# EAGLE design avr_programming_shield_v2 (EAGLE 6.3)
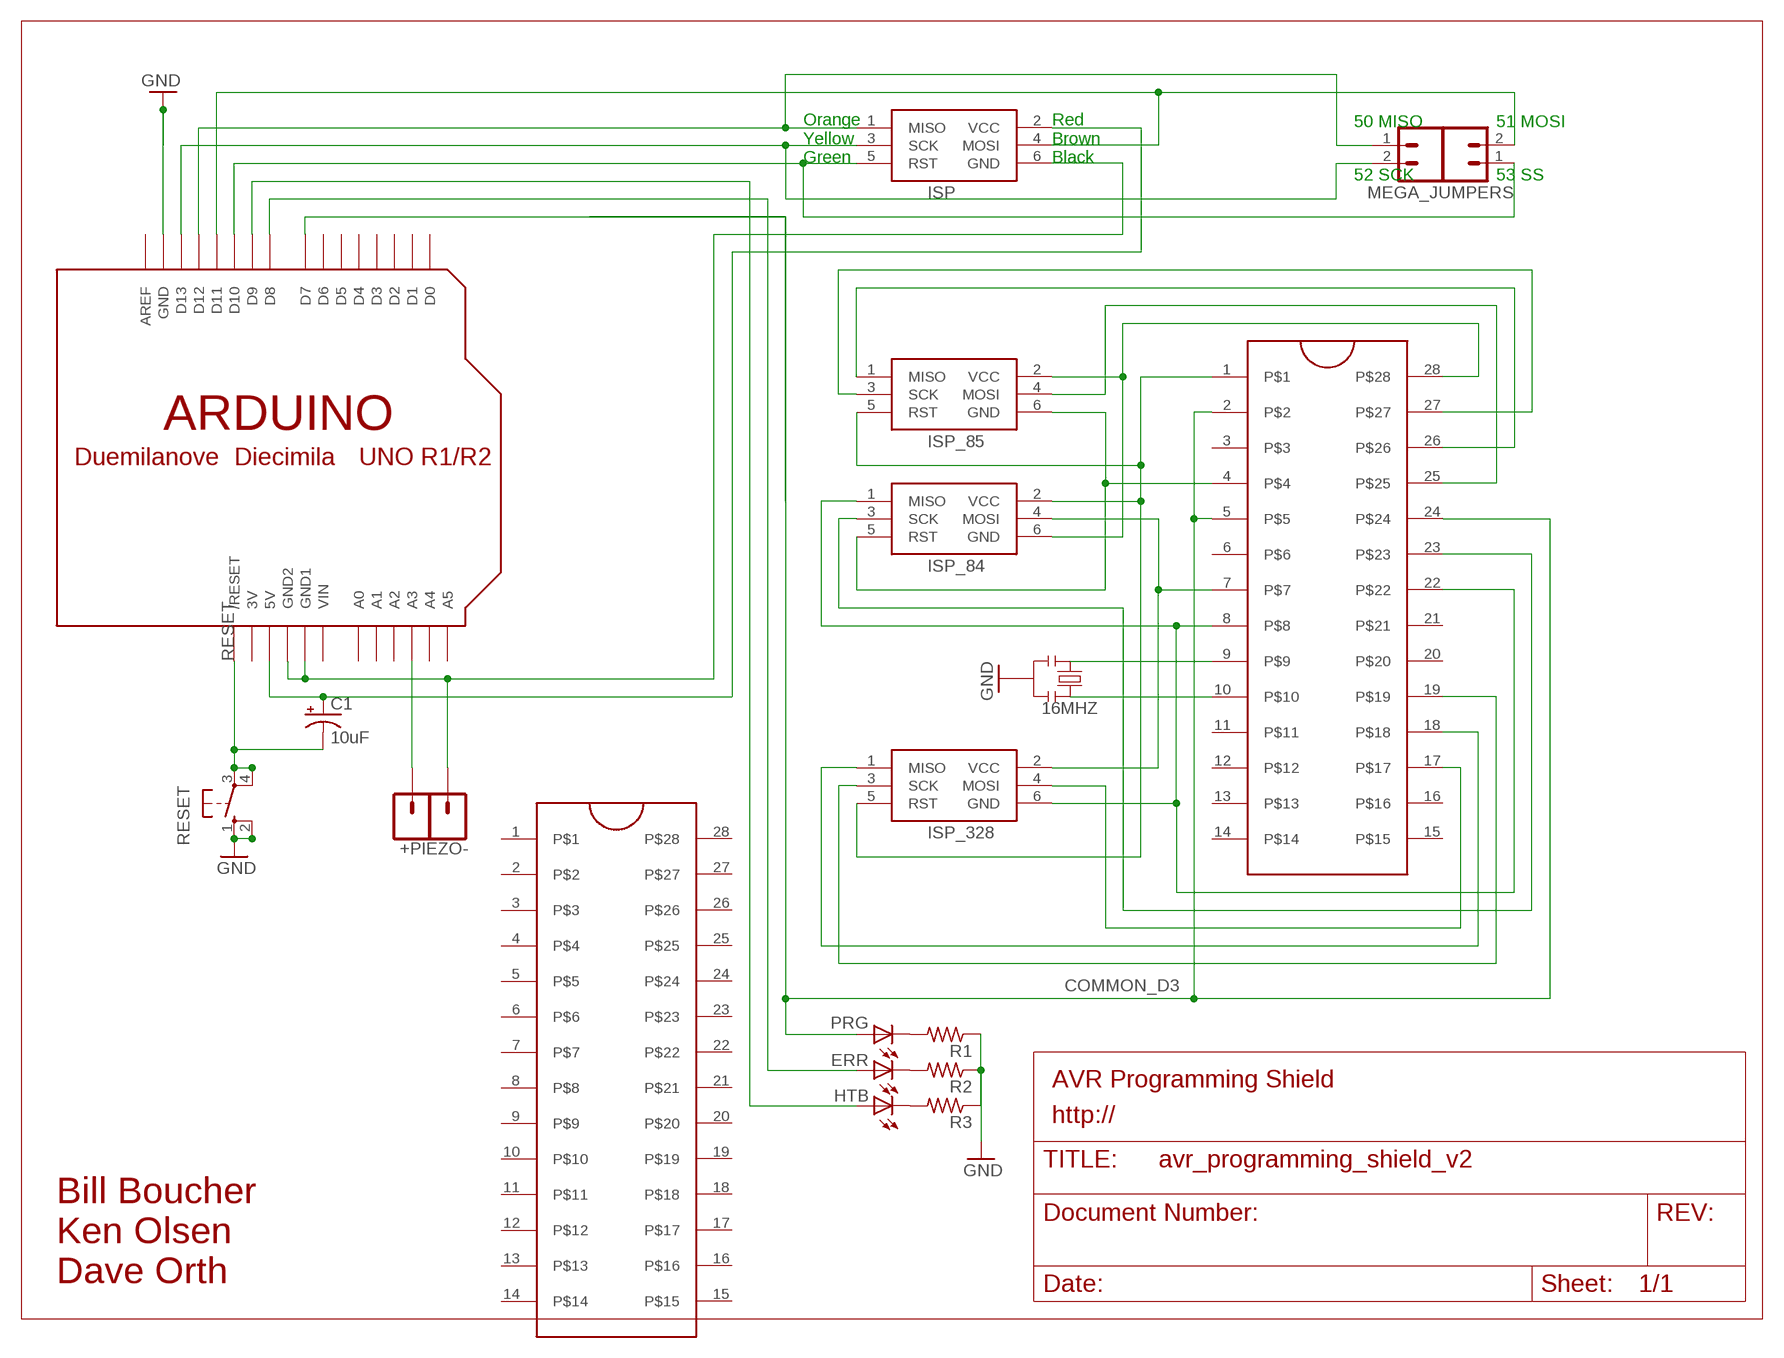
[diagram p0: schematic, sheet 1]

## Parts
16MHZ  RESONATORPTH  [RESONATOR-PTH]
+PIEZO-  M01PTH  [1X01]
C1  10uF  CAP_POLPTH2  [CPOL-RADIAL-10UF-25V]
ERR  LED3MM  [LED3MM]
HTB  LED3MM  [LED3MM]
ISP  AVRISP-6  [AVRISP]
ISP_84  AVRISP-6  [AVRISP]
ISP_85  AVRISP-6  [AVRISP]
ISP_328  AVRISP-6  [AVRISP]
JP2  M02PTH  [1X02]
JP4  M01PTH  [1X01]
MEGA_JUMPERS  M02PTH  [1X02]
PRG  LED3MM  [LED3MM]
R1  R-US_0204/2V  [0204V]
R2  R-US_0204/2V  [0204V]
R3  R-US_0204/2V  [0204V]
RESET  10-XX  [B3F-10XX]
U$1  ARDUINO-NOHOLE  [ARDUINO-NOHOLE]
U$3  ZIFSOCKET-28-3ZIFFSOCKET-28-3  [DIL28-3-ZIF_SOCKET]
U$4  ZIFSOCKET-28-3ZIFFSOCKET-28-3  [DIL28-3-ZIF_SOCKET]

## Nets
COMMON_D3: PRG.A U$1.D7 U$4.2 U$4.5 U$4.24
GND [power]: 16MHZ.2 +PIEZO-.1 ISP.6(GND) R1.1 R2.1 R3.1 RESET.1(S) RESET.2(S1) U$1.GND U$1.GND1 U$1.GND2
N$1: ISP_328.4(MOSI) U$4.17
N$2: ISP.3(SCK) MEGA_JUMPERS.2 U$1.D13
N$3: ISP.1(MISO) MEGA_JUMPERS.1 U$1.D12
N$4: ISP_328.1(MISO) U$4.18
N$5: ISP.5(RST) JP2.1 U$1.D10
N$6: ISP.4(MOSI) JP2.2 U$1.D11
N$7: ISP_328.3(SCK) U$4.19
N$8: PRG.K(C) R1.2
N$9: ERR.K(C) R2.2
N$10: HTB.K(C) R3.2
N$11: ISP_84.4(MOSI) ISP_328.2(VCC) U$4.7
N$12: JP4.1 U$1.A3
N$13: ISP_84.2(VCC) ISP_85.5(RST) ISP_328.5(RST) U$4.1
N$15: ISP_84.3(SCK) U$4.23
N$16: ISP_84.6(GND) ISP_85.2(VCC) U$4.28
N$17: HTB.A U$1.D9
N$18: ISP_84.5(RST) ISP_85.6(GND) U$4.4
N$19: ISP_85.4(MOSI) U$4.25
N$20: ISP_85.1(MISO) U$4.26
N$21: ISP_85.3(SCK) U$4.27
N$22: 16MHZ.1 U$4.9
N$24: ERR.A U$1.D8
N$25: 16MHZ.3 U$4.10
N$26: ISP_84.1(MISO) ISP_328.6(GND) U$4.8 U$4.22
RESET: C1.2(-) RESET.3(P) RESET.4(P1) U$1.RESET(/RESET)
VCC: C1.1(+) ISP.2(VCC) U$1.5V
Unconnected: U$1.A0 U$1.A1 U$1.A2 U$1.A4 U$1.A5 U$1.AREF U$1.D0 U$1.D1 U$1.D2 U$1.D3 U$1.D4 U$1.D5 U$1.D6 U$3.1 U$3.2 U$3.3 U$3.4 U$3.5 U$3.6 U$3.7 U$3.8 U$3.9 U$3.10 U$3.11 U$3.12 U$3.13 U$3.14 U$3.15 U$3.16 U$3.17 U$3.18 U$3.19 U$3.20 U$3.21 U$3.22 U$3.23 U$3.24 U$3.25 U$3.26 U$3.27 U$3.28 U$4.3 U$4.6 U$4.11 U$4.12 U$4.13 U$4.14 U$4.15 U$4.16 U$4.20 U$4.21

## Notes on the sheet
- 50 MISO | 51 MOSI
- Orange
  Yellow
  Green
- Red
  Brown
  Black
- 52 SCK | 53 SS
- AVR Programming Shield
- http://
- Bill Boucher
  Ken Olsen
  Dave Orth

## Power pins joined to a net without a drawn wire
3V: U$1.3V
VIN: U$1.VIN

## Library data of the parts
16MHZ = SparkFun_mod:RESONATOR: Resonator Small SMD resonator. This is the itty bitty 10/20MHz resonators with built in caps. CSTCE10M0G55 and CSTCE20M0V53. Footprint has been reviewed closely but hasn't been tested yet.; OC_NEWARK: unknown
+PIEZO- JP4 = SparkFun-Connectors_mod:M01: Header 1 Standard 1-pin 0.1" header. Use with straight break away headers (SKU : PRT-00116), right angle break away headers (PRT-00553), swiss pins (PRT-00743), machine pins (PRT-00117), and female headers (PRT-00115).; OC_NEWARK: unknown
C1 = SparkFun:CAP_POL: Capacitor Polarized These are standard SMD and PTH capacitors. Normally 10uF, 47uF, and 100uF in electrolytic and tantalum varieties. Always verify the external diameter of the through hole cap, it varies with capacity, voltage, and manufacturer. The EIA devices should be standard.; MF: ILLINOIS CAPACITOR,INC.; MPN: 106TTA035M; OC_NEWARK: 30K6594
ERR HTB PRG = adafruit:LED: LED OSRAM: - CHIPLED LG R971, LG N971, LY N971, LG Q971, LY Q971, LO R971, LY R971 LH N974, LH R974 LS Q976, LO Q976, LY Q976 LO Q996 - Hyper CHIPLED LW Q18S LB Q993, LB Q99A, LB R99A - SideLED LS A670, LO A670, LY A670, LG A670, LP A670 LB A673, LV A673, LT A673, LW A673 LH A674 LY A675 LS A676, LA A676, LO A676, LY A676, LW A676 LS A679, LY A679, LG A679 - Hyper Micro SIDELED® LS Y876, LA Y876, LO Y876, LY Y876 LT Y87S - SmartLED LW L88C, LW L88S LB L89C, LB L89S, LG L890 LS L89K, LO L89K, LY L89K LS L896, LA L896, LO L896, LY L896 - TOPLED LS T670, LO T670, LY T670, LG T670, LP T670 LSG T670, LSP T670, LSY T670, LOP T670, LYG T670 LG T671, LOG T671, LSG T671 LB T673, LV T673, LT T673, LW T673 LH T674 LS T676, LA T676, LO T676, LY T676, LB T676, LH T676, LSB T676, LW T676 LB T67C, LV T67C, LT T67C, LS T67K, LO T67K, LY T67K, LW E67C LS E67B, LA E67B, LO E67B, LY E67B, LB E67C, LV E67C, LT E67C LW T67C LS T679, LY T679, LG T679 LS T770, LO T770, LY T770, LG T770, LP T770 LB T773, LV T773, LT T773, LW T773 LH T774 LS E675, LA E675, LY E675, LS T675 LS T776, LA T776, LO T776, LY T776, LB T776 LHGB T686 LT T68C, LB T68C - Hyper Mini TOPLED® LB M676 - Mini TOPLED Santana® LG M470 LS M47K, LO M47K, LY M47K Source: http://www.osram.convergy.de/; OC_NEWARK: unknown
ISP ISP_84 ISP_85 ISP_328 = adafruit:AVRISP: AVR ISP HEADER Standard 6 pin header for AVR programming; OC_NEWARK: unknown
JP2 MEGA_JUMPERS = SparkFun:M02: Header 2 Standard 2-pin 0.1" header. Use with straight break away headers (SKU : PRT-00116), right angle break away headers (PRT-00553), swiss pins (PRT-00743), machine pins (PRT-00117), and female headers (PRT-00115). Molex polarized connector foot print use with SKU : PRT-08233 with associated crimp pins and housings.; OC_NEWARK: unknown
R1-R3 = adafruit:R-US_: RESISTOR, American symbol; OC_NEWARK: unknown
RESET = switch-omron:10-XX: OMRON SWITCH; MPN: B3F-1000; OC_FARNELL: 176432; OC_NEWARK: 36M3542
U$1 = adafruit:ARDUINO: Arduino Diecimila/Duemilanove Make a shield with ease, this package has all the named pins as well as the two mounting drill holes and an outline of the USB and DC power connector. The outline is on the DIMENSION layer, so if your board house uses it they will cut the outline to match. http://www.ladyada.net/library/pcb/eaglelibrary.html; OC_NEWARK: unknown
U$3 = SparkFun:ZIFSOCKET-28-3
U$4 = SparkFun_mod:ZIFSOCKET-28-3; OC_NEWARK: unknown

## Net classes
1 power: width 0.61 mm

## Board
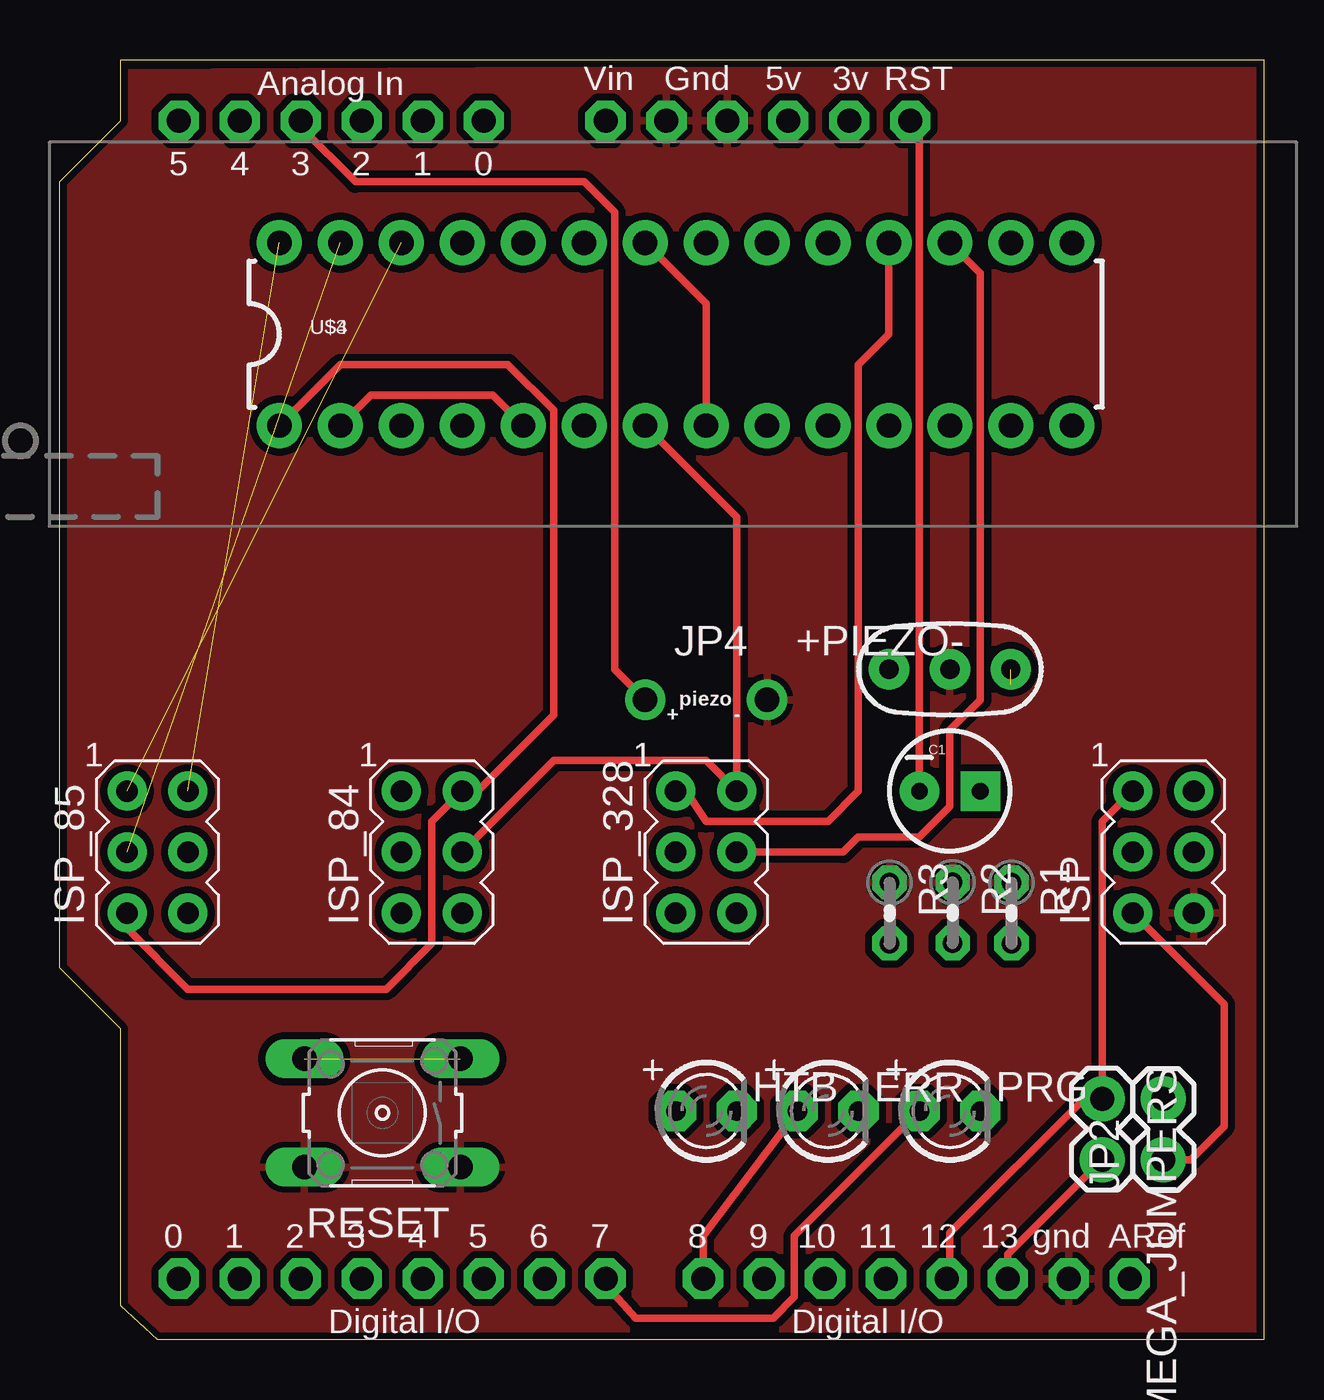
[diagram p1: board, top side]
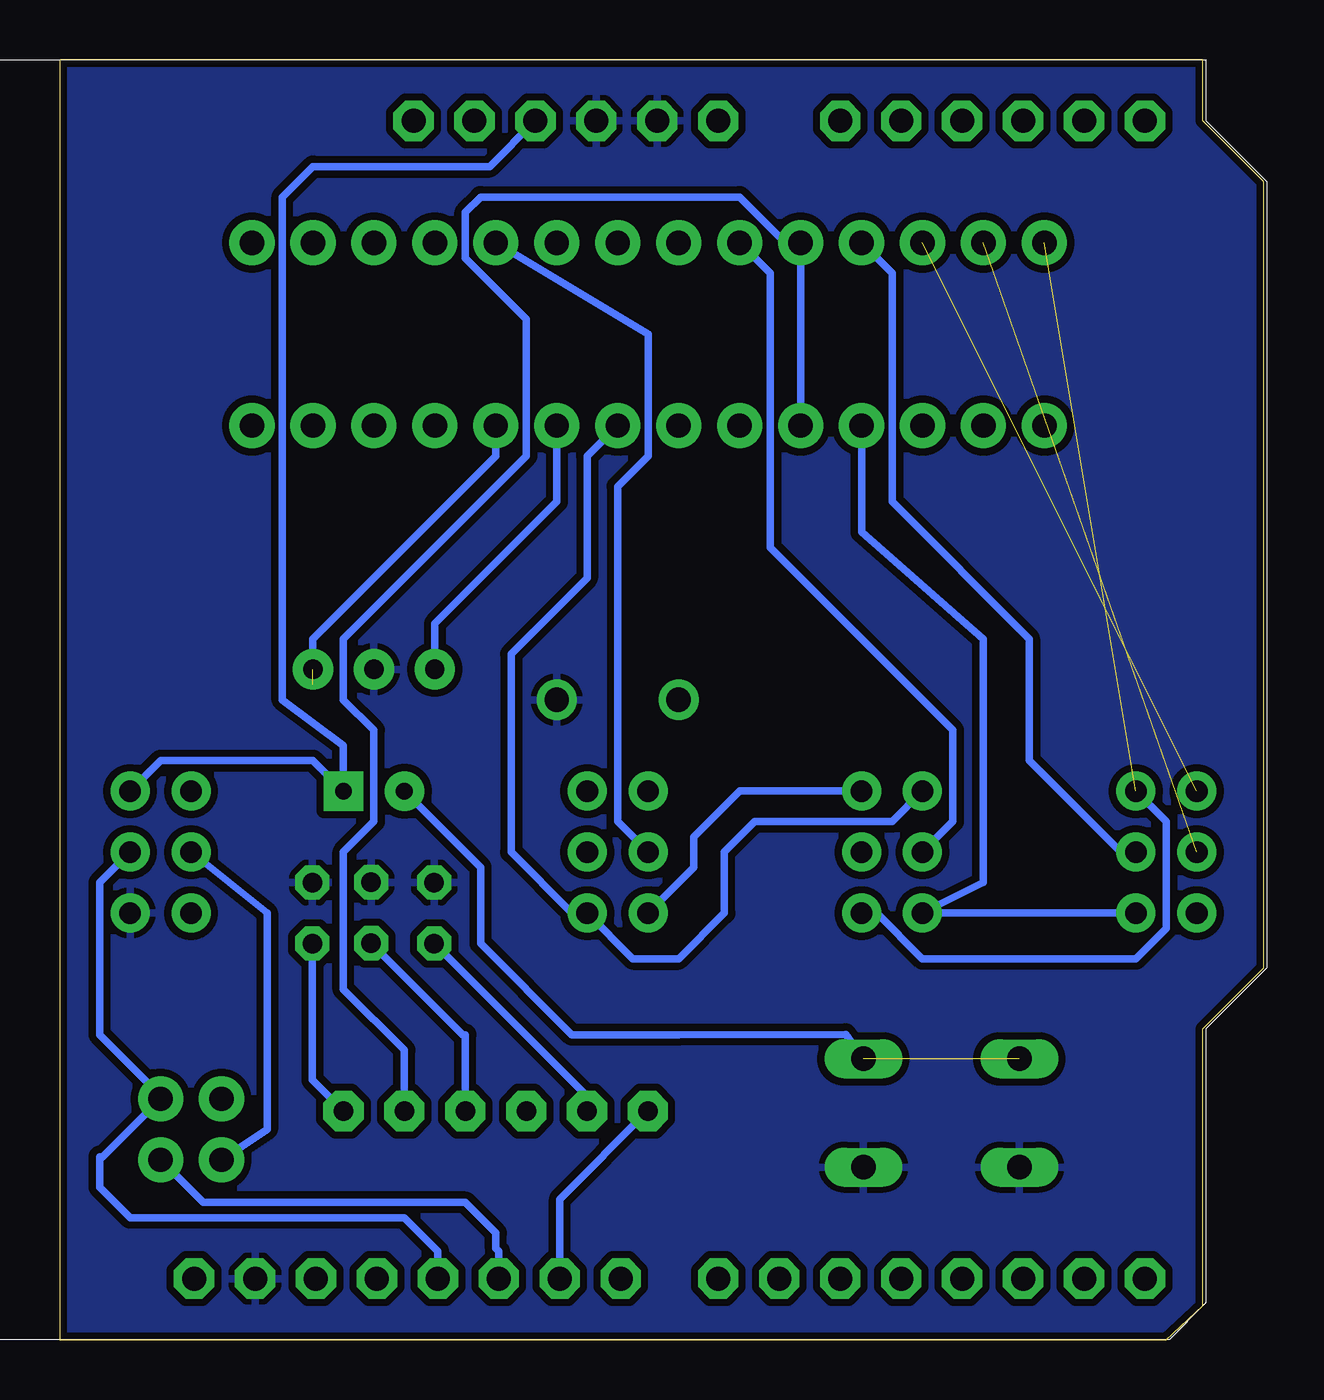
[diagram p2: board, bottom side, seen from below]

Size 50.16 x 53.34 mm. Coordinates in mm from the lower left corner, seen from the top.
Outline: 2.54,53.34 50.16,53.34 50.16,0 4.06,0 2.54,1.4 2.54,12.95 0,15.49 0,48.26 2.54,50.8 2.54,53.34
Copper layers (1*16): Top 0.035mm / dielectric 1.5mm / Bottom 0.035mm
Design rules "SparkFun": minimum track width 8mil, minimum drill 20mil, track to track 8mil, track to pad 8mil, pad to pad 8mil, via to via 8mil, smd to smd 8mil, copper to edge 10mil, drill to drill 8mil, minimum pad ring 12mil, minimum via ring 10mil, stop-mask expansion 4mil, vias tented up to drill 25mil, thermal gap 10mil

### Footprints (pad centres in the part's own frame; a part is rotated, then mirrored left to right if it is on the bottom)
RESONATOR-PTH = drill 0.8 pad 1.676: 1 -2.54,0; 2 0,0; 3 2.54,0
1X01 = drill 1.016 pad 1.676: 1 0,0
CPOL-RADIAL-10UF-25V = drill 0.7 pad 1.651 square: 1 1.27,0 | drill 0.7 pad 1.651: 2 -1.27,0
LED3MM = drill 0.813 pad 1.676 octagon: A -1.27,0; K 1.27,0
AVRISP = drill 0.9 pad 1.626: 1 -1.27,2.54; 2 1.27,2.54; 3 -1.27,0; 4 1.27,0; 5 -1.27,-2.54; 6 1.27,-2.54
1X02 = drill 1.016 pad 1.88: 1 0,0; 2 2.54,0
0204V = drill 0.813 octagon: 1 -1.27,0; 2 1.27,0
B3F-10XX = drill 1.016 long: 1 -3.251,2.261; 2 3.251,2.261; 3 -3.251,-2.261; 4 3.251,-2.261
ARDUINO-NOHOLE = drill 1 pad 1.676 octagon: 3V 35.56,2.54; 5V 38.1,2.54; A0 50.8,2.54; A1 53.34,2.54; A2 55.88,2.54; A3 58.42,2.54; A4 60.96,2.54; A5 63.5,2.54; AREF 23.876,50.8; D0 63.5,50.8; D1 60.96,50.8; D2 58.42,50.8; D3 55.88,50.8; D4 53.34,50.8; D5 50.8,50.8; D6 48.26,50.8; D7 45.72,50.8; D8 41.656,50.8; D9 39.116,50.8; D10 36.576,50.8; D11 34.036,50.8; D12 31.496,50.8; D13 28.956,50.8; GND 26.416,50.8; GND1 43.18,2.54; GND2 40.64,2.54; RESET 33.02,2.54; VIN 45.72,2.54
DIL28-3-ZIF_SOCKET = drill 1.016 pad 1.88: 1 -16.51,-3.81; 2 -13.97,-3.81; 3 -11.43,-3.81; 4 -8.89,-3.81; 5 -6.35,-3.81; 6 -3.81,-3.81; 7 -1.27,-3.81; 8 1.27,-3.81; 9 3.81,-3.81; 10 6.35,-3.81; 11 8.89,-3.81; 12 11.43,-3.81; 13 13.97,-3.81; 14 16.51,-3.81; 15 16.51,3.81; 16 13.97,3.81; 17 11.43,3.81; 18 8.89,3.81; 19 6.35,3.81; 20 3.81,3.81; 21 1.27,3.81; 22 -1.27,3.81; 23 -3.81,3.81; 24 -6.35,3.81; 25 -8.89,3.81; 26 -11.43,3.81; 27 -13.97,3.81; 28 -16.51,3.81
DIL28-3-ZIF_SOCKET' = drill 1.016 pad 1.676: 1 -16.51,-3.81; 2 -13.97,-3.81; 3 -11.43,-3.81; 4 -8.89,-3.81; 5 -6.35,-3.81; 6 -3.81,-3.81; 7 -1.27,-3.81; 8 1.27,-3.81; 9 3.81,-3.81; 10 6.35,-3.81; 11 8.89,-3.81; 12 11.43,-3.81; 13 13.97,-3.81; 14 16.51,-3.81; 15 16.51,3.81; 16 13.97,3.81; 17 11.43,3.81; 18 8.89,3.81; 19 6.35,3.81; 20 3.81,3.81; 21 1.27,3.81; 22 -1.27,3.81; 23 -3.81,3.81; 24 -6.35,3.81; 25 -8.89,3.81; 26 -11.43,3.81; 27 -13.97,3.81; 28 -16.51,3.81

### Placement (x,y rotation side)
16MHZ  37.08,27.94 0 top
+PIEZO-  29.46,26.67 0 top
C1  37.08,22.86 0 top
E$1  [OSHWLOGO_TOL_0.2]  -6.1,32.64 270 top  (outside the outline)
ERR  32,9.53 0 top
HTB  26.94,9.53 0 top
ISP  45.97,20.32 0 top
ISP_84  15.49,20.32 0 top
ISP_85  4.06,20.32 0 top
ISP_328  26.92,20.32 0 top
JP2  45.97,7.49 90 top
JP4  24.38,26.67 0 top
MEGA_JUMPERS  43.43,10.03 270 top
PRG  37.08,9.53 0 top
R1  39.65,17.78 270 top
R2  37.2,17.79 270 top
R3  34.57,17.78 270 top
RESET  13.44,9.45 180 top
U$1  68.45,53.34 180 top
U$2  [OSHWLOGO_BOTTOM]  39.62,34.92 0 top
U$3  25.65,41.91 0 top
U$4  ZIFSOCKET-28-3ZIFFSOCKET-28-3  [DIL28-3-ZIF_SOCKET']  25.65,41.91 0 top

### Tracks (layer width: path | path; a pad name or v marks a point on that pad's centre or on a via)
COMMON_D3
  Top 0.305: 36.45,9.53 PRG.A 30.61,4.32 30.61,1.78 29.72,0.89 24,0.89 22.73,2.29 U$1.D7 | U$4.2 12.95,39.37 18.03,39.37 U$4.5
  Bottom 0.305: PRG.A 35.81,12.06 38.35,14.61 38.35,20.32 37.08,21.59 37.08,25.4 38.35,26.67 38.35,29.21 30.73,36.83 30.73,42.55 33.27,45.09 33.27,46.99 32.64,47.62 21.84,47.62 19.94,45.72 U$4.24 U$4.5
GND
  pour Bottom (isolate 0.305): -15.88,53.34 50.8,53.98 50.16,-1.14 -16.51,-0.64
  pour Top (isolate 0.305): -15.88,52.7 50.55,53.09 50.29,-0.38 -15.88,-1.02
N$1
  Top 0.305: U$4.17 38.35,44.45 38.35,26.67 37.08,25.4 37.08,22.23 35.81,20.95 33.27,20.95 32.64,20.32 ISP_328.4
N$2
  Top 0.305: U$1.D13 39.5,3.56 MEGA_JUMPERS.2
  Bottom 0.305: ISP.3 41.53,17.78 41.53,8.76 MEGA_JUMPERS.2
N$3
  Top 0.305: ISP.1 43.43,21.59 MEGA_JUMPERS.1 42.67,10.03 37.08,4.45 37.08,2.67 U$1.D12
N$4
  Top 0.305: U$4.18 34.54,41.91 33.27,40.64 33.27,22.86 32,21.59 26.92,21.59 25.65,23.5 ISP_328.1
N$5
  Top 0.305: JP2.1 47.12,7.49 48.51,8.89 48.51,13.97 ISP.5
  Bottom 0.305: U$1.D10 31.88,3.68 32,3.81 32,4.45 33.27,5.71 44.2,5.71 JP2.1
N$6
  Bottom 0.305: ISP.4 48.51,19.05 48.51,12.7 45.97,10.16 JP2.2 48.39,7.62 48.51,7.62 48.51,6.35 47.24,5.08 35.81,5.08 34.42,3.68 U$1.D11
N$7
  Bottom 0.305: U$4.19 25.65,41.91 25.65,36.83 26.92,35.56 26.92,21.59 ISP_328.3
N$8
  Bottom 0.305: R1.2 39.65,10.82 PRG.K
N$9
  Bottom 0.305: ERR.K 33.27,12.7 33.38,12.7 R2.2
N$10
  Bottom 0.305: HTB.K 28.21,10.15 R3.2
N$11
  Top 0.305: U$4.7 28.19,34.29 ISP_328.2 26.92,24.13 20.57,24.13 ISP_84.4
N$12
  Top 0.305: JP4.1 23.11,27.94 23.11,46.99 21.84,48.26 12.32,48.26 10.03,50.55 U$1.A3
N$13
  Top 0.305: ISP_85.5 2.79,17.14 5.33,14.61 13.59,14.61 15.49,16.51 15.49,21.59 ISP_84.2 17.4,22.86 20.57,26.04 20.57,38.73 18.67,40.64 11.68,40.64 U$4.1
  Bottom 0.305: ISP_84.2 21.84,22.86 23.75,20.95 23.75,19.68 ISP_328.5
N$15
  Bottom 0.305: U$4.23 20.57,44.45 20.57,33.02 12.95,25.4 12.95,21.59 ISP_84.3
N$16  (1 unrouted)
  Bottom 0.305: ISP_85.2 4.06,21.59 4.06,17.14 5.33,15.88 14.22,15.88 16.13,17.78 ISP_84.6
N$17
  Bottom 0.305: U$1.D9 29.34,5.86 HTB.A
N$18
  Bottom 0.305: ISP_85.6 ISP_84.5 11.68,19.05 11.68,29.21 16.76,33.66 U$4.4
N$19
  Bottom 0.305: U$4.25 15.49,44.45 15.49,34.92 9.78,29.21 9.78,24.13 5.97,20.32 ISP_85.4
N$20  (1 unrouted)
N$21  (1 unrouted)
N$22
  Bottom 0.305: U$4.9 29.46,34.92 34.54,29.84 16MHZ.1
N$24
  Top 0.305: U$1.D8 26.8,4.32 ERR.A
N$25  (1 unrouted)
  Bottom 0.305: U$4.10 32,36.83 39.62,29.21 39.62,27.3
N$26
  Top 0.305: U$4.22 26.92,43.18 U$4.8
  Bottom 0.305: ISP_84.1 15.49,21.59 21.21,21.59 22.48,20.32 22.48,17.78 24.38,15.88 26.29,15.88 ISP_328.6 28.83,17.78 31.37,20.32 31.37,28.57 28.19,31.75 28.19,36.83 U$4.8
RESET  (1 unrouted)
  Top 0.305: C1.2 35.81,50.42 U$1.RESET
  Bottom 0.305: RESET.3 17.42,12.72 24.38,12.7 28.83,12.7 32.64,16.51 32.64,19.68 C1.2
VCC
  Bottom 0.305: ISP.2 45.97,24.13 39.62,24.13 C1.1 38.35,24.77 40.89,26.67 40.89,47.62 39.62,48.9 32.26,48.9 U$1.5V

### Text on the board
tPlace: Open Source / Hardware | + | piezo | -
tDocu: 1 | Jumper ISP | to target chip | Tools -> Boards | Insert target chip | Place ISP jumper | Upload ArduinoISP | Burn bootloader | 45/85 | 44/84 | 168/328 | ISP | D3 | Mega / jumpers | 50 | 51 | 52 | 53 | Heart | Error | Prog | Reset
bDocu: Open Source / Hardware | Avr Programming Shield / Jan 2013